# Altium schematic sheet Single_Stage.SchDoc
size A4; SheetNumber: 1; SheetTotal: 1
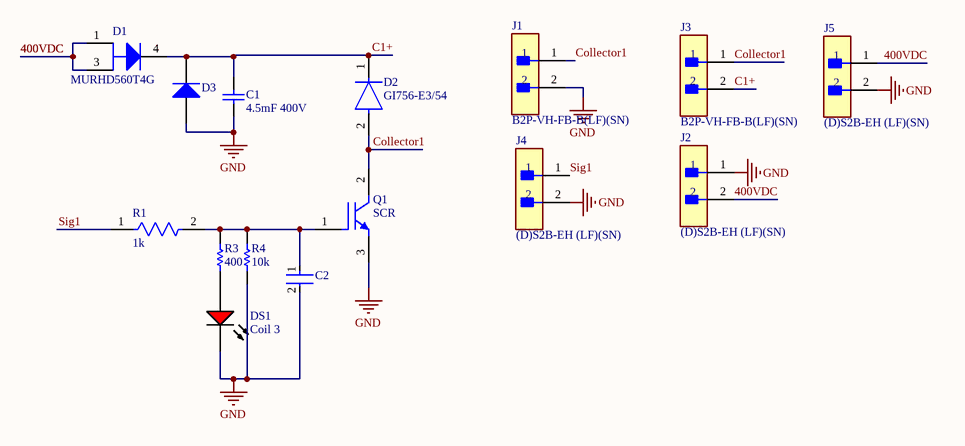
[diagram p0: Single_Stage.SchDoc]

## Parts
C1  value 4.5mF 400V  (hidden comment: asas)
C2  CGA3E2X7R1H104K080AA  [FP-CGA3E-0_3-0_1-IPC_A]  (value not drawn)
D1  MURHD560T4G  [ONSC-DPAK-3-369C-01_V]
D2  GI756-E3/54  [FP-P600-MFG]
D3  R  [DIOD-S1M-13-F-SMA-2_V]  (value not drawn)
DS1  Coil 3  [VISH-TLMX1100_V]
J1  B2P-VH-FB-B(LF)(SN)  [FP-B2P-VH-FB-B_LF_SN-MFG]
J2  (D)S2B-EH (LF)(SN)  [FP-D_S2B-EH_LF_SN-MFG]
J3  B2P-VH-FB-B(LF)(SN)  [FP-B2P-VH-FB-B_LF_SN-MFG]
J4  (D)S2B-EH (LF)(SN)  [FP-D_S2B-EH_LF_SN-MFG]
J5  (D)S2B-EH (LF)(SN)  [FP-D_S2B-EH_LF_SN-MFG]
Q1  SCR  [INF-PG-TO247-3-44_A]
R1  1k  [FP-CRCW2512-e3-MFG]
R3  400  [RESC1609X50X30NL8T20]
R4  10k  [RESC1609X50X30NL8T20]

## Nets
GND: C1.1 C2.2 D3.1(A) DS1.2(K) J1.2 J2.1 J4.2 J5.2 Q1.3(E) R4.1
400VDC: D1.1(A) D1.3(A) J2.2 J5.1
C1+: C1.2 D1.4(K) D2.1(C) D3.2(K) J3.2
Collector1: D2.2(A) J1.1 J3.1 Q1.2(C)
Sig1: J4.1 R1.1
NetC2_1: C2.1 Q1.1(G) R1.2 R3.2 R4.2
NetDS1_1: DS1.1(A) R3.1

## Library data of the parts
C1 = Capacitor: SimulationGenericComponent: True
C2 = CMP-2000-07546-2: Cap Ceramic 100nF 50V X7R 10% Pad SMD 0603 +125°C Automotive T/R; Weight: 7.1E-05oz; Composition: Ceramic; Max Operating Temperature: 125°C; Termination: SMD/SMT; Dielectric: X7R; Length: 1.6mm; Package Quantity: 1; REACH SVHC: No SVHC; Lead Free: Lead Free; Case Code (Metric): 1608; Min Operating Temperature: -55°C; Packaging: Tape and Reel; Tolerance: 10%; Voltage Rating: 50V; Case Code (Imperial): 0603; Capacitance: 100nF; Case/Package: 0603; Voltage Rating (DC): 50V; Depth: 0.8mm; Radiation Hardening: No; Ratings: AEC-Q200; Mount: Surface Mount; Voltage: 50V; Thickness: 0.035inch; Width: 0.8mm; Height: 0.8mm
D1 = CMP-0902-00243-1: Power Rectifier, 3-Pin DPAK, Pb-Free, Tape and Reel; Manufacturer: On Semiconductor; Type: Ultrafast; VRRM Max (V): 600; IFSM Max (A): 50; Mounting Technology: Surface Mount; RoHS: TRUE; PartNumber: MURHD560T4G; PackageVersion: Rev. E, 02/2014; ComponentLink3URL: http://www.onsemi.cn/pub_link/Collateral/369C.PDF; ComponentLink1Description: Manufacturer URL; PackageDescription: 3-Pin Flange Mount, Body 6.54 x 6.095 mm, Pitch 2.29 mm; ComponentLink3Description: Package Specification; ComponentLink1URL: http://www.onsemi.com/; Packing: Tape and Reel; ComponentLink2URL: http://www.onsemi.cn/pub_link/Collateral/MURHD560-D.PDF; ComponentLink2Description: Datasheet; PackageReference: DPAK-3-369C-01; DatasheetVersion: Rev. 8
D2 = CMP-02540-000099-1: DIODE GEN PURP 600V 6A P600; Capacitance: 150pF; Max Surge Current: 400A; Max Reverse Current: 5uA; Forward Voltage: 1.25V; Diode Type: RECTIFIER; Element Configuration: Single; Recovery Time: 2500ns; Voltage: 1.2kV; Polarity: Standard; Case/Package: P; Forward Current: 6A; Mount: Through Hole; Diameter: 9.1mm; Peak Non-Repetitive Surge Current: 400A; Average Rectified Current: 6A; Max Forward Surge Current (Ifsm): 400A; Width: 9.1mm; RoHS Compliant: Yes; Max Reverse Voltage (DC): 600V; Number of Pins: 2; Lead Free: Lead Free; Max Repetitive Reverse Voltage (Vrrm): 600V; Packaging: Tape and Reel; Output Current: 6A; Length: 0.358inch; Max Operating Temperature: 150°C; Current: 400A; Radiation Hardening: No; Height: 9.1mm; Reverse Voltage: 600V; Min Operating Temperature: -50°C; Package Quantity: 1; Reverse Recovery Time: 2500ns
D3 = CMP-0639-00001-1: Surface Mount Glass Passivated Rectifier, 1000V, 1 A, -65 to 125 degC, 2-Pin SMA Package, RoHS, Tape and Reel; Manufacturer: Diodes Inc; PartNumber: S1M-13-F; Maximum Reverse Current IR (uA): 5; Maximum Peak Forward Surge Current IFSM (A): 30; Maximum Average Rectified Current IO (A): 1; Peak Repetitive Reverse Voltage VRRM (V): 1000; Total Capacitance CT (pF): 10; Forward Voltage Drop VF (V): 1.1; ComponentLink1URL: http://www.diodes.com/; Operating Temperature Range: -65 to 150 degC; ComponentLink3URL: http://diodes.com/datasheets/ds16003.pdf; ComponentLink3Description: Package Specification; PackageDescription: 2-Pin SMD, Body 4.3 x 2.605 mm, Height 2.3 mm; Mounting Technology: Surface Mount; ComponentLink1Description: Manufacturer URL; PackageReference: S1M-13-F-SMA-2; ComponentLink2URL: http://diodes.com/datasheets/ds16003.pdf; ComponentLink2Description: Datasheet; RoHS: TRUE; DatasheetVersion: Rev. 22 - 2; Packing: Tape and Reel; PackageVersion: Rev. 22 - 2
DS1 = CMP-1666-00027-1: LED, RED, 2.1 V, -40 to 100 degC, 2-Pin SMD (0603), RoHS, Tape and Reel; Type (Capacitors): C0G; Resistance: 100000000000 Ohm; Capacitance: 12 pF; Voltage Rating: 50 V; Tolerance: 5%; Min Operating Temperature: -55degC; REACH SVHC: No SVHC; ComponentLink2Description: Datasheet; ComponentLink1URL: http://www.vishay.com/; Width: 0.8 mm; Package Quantity: 4000; PackageReference: TLMX1100; ComponentLink2URL: http://www.vishay.com/docs/83173/tlmb1100.pdf; Case/Package: 0603; Case Code (Metric): 1608; Packaging: Tape and Reel; Pins: 2; ComponentLink1Description: Manufacturer URL; Max Operating Temperature: 125degC; Height: 0.8 mm; Length: 1.6 mm; Mount: Surface Mount; PackageDescription: 2-Pin Surface Mount Device, Body 1.6 x 0.8 mm; DatasheetVersion: Rev. 2.7, 03/2016; Case Code (Imperial): 0603; Voltage Rating (DC): 50 V; RoHSCompliant: True; Radiation Hardening: No
J1 J3 = CMP-17439-000031-1: CONN HEADER VERT 2POS 3.96MM; Connector Type: Male Pin; Pitch: 0.156inch; Number of Positions: 2; Packaging: Bulk; Package Quantity: 250; Termination: Solder; Lead Free: Lead Free; Contact Plating: Tin; Contact Type: Male Pin; Color: Natural; Fastening Type: Ramp; Number of Rows: 1; Mount: Through Hole; Series: VH
J2 J4 J5 = CMP-17439-000238-1: CONN HEADER R/A 2POS 2.5MM
Q1 = CMP-1168-00055-1: High Speed IGBT in NPT-Technology, PG-TO247-3-44, Tube, Green; PartNumber: SGW30N60HS; Manufacturer: Infineon; Switching Frequency: HighSpeed 30-100 kHz; VCE(sat) (typ): 2.8 V; IC(max) @ 100 degC: 30 A; IC(max) @ 25 degC: 41 A; VCE (max): 600 V; Green: TRUE; ComponentLink1Description: Manufacturer URL; ComponentLink2URL: http://www.infineon.com/dgdl/SGP_W30N60HS_Rev2_4G.pdf?folderId=db3a304412b407950112b408e8c90004&fileId=db3a304412b407950112b427ac823c95; Packing: Tube; DatasheetVersion: Rev. 2.4; PackageReference: PG-TO247-3-44_A; PackageVersion: Rev. 05, 07/2010; ComponentLink2Description: Datasheet; Halogen-free: FALSE; PackageDescription: 3-Pin Plastic (Green) Transistor Single Outline Package, Body 15.915 x 20.95 mm, Pitch 5.44 mm; ComponentLink3Description: Package Specification; RevisionNote: Lost Devices pt2; ComponentLink3URL: http://www.infineon.com/dgdl/IDW10S120_Rev+2.pdf?folderId=db3a304314dca38901151224afae0c96&fileId=db3a304336724dc40136789691a04aa5; Mounting Technology: Through Hole; ComponentLink1URL: http://www.infineon.com/
R1 = CMP-02407-004199-1: RES Thick Film, 100kΩ, 1%, 1W, 100ppm/°C, 2512; Voltage Rating: 500V; Resistance: 100kR; Case Code (Metric): 6432; Temperature Coefficient: 100ppm/°C; Weight: 0.001429oz; Radiation Hardening: No; Voltage Rating (DC): 500V; Case Code (Imperial): 2512; Length: 6.3mm; Number of Pins: 2; Military Standard: Not; Packaging: Tape and Reel; Contact Plating: Tin; Width: 3.15mm; Lead Free: Lead Free; Package Quantity: 2000; Composition: Thick Film; Termination: SMD/SMT; Number of Terminations: 2; Features: Automotive AEC-Q200; Max Power Dissipation: 1W; Case/Package: 2512; Min Operating Temperature: -55°C; Depth: 3.15mm; Max Operating Temperature: 155°C; Tolerance: 1%; Power Rating: 1W; Height: 0.6mm
R3 R4 = CMP-1666-00005-4: Chip Resistor, 10 KOhm, +/- 1%, 100 mW, -55 to 155 degC, 0603 (1608 Metric), RoHS, Tape and Reel; Manufacturer: Vishay Semiconductor; Voltage Rating: 75 V; Max Operating Temperature: 155 degC; PackageDescription: 2-Pin Surface Mount Device, Body 1.575 x 0.85 mm; ComponentLink1Description: Manufacturer URL; RoHSCompliant: true; PackageReference: 0603; REACH SVHC: Unknown; Length: 1.55 mm; DatasheetVersion: 06/2012; Packaging: Tape and Reel; Min Operating Temperature: -55 degC; Mounting Technology: Surface Mount; ComponentLink2URL: https://datasheet.ciiva.com/11809/0900766b80d98afc-11809037.pdf; Height: 0.45 mm; ComponentLink2Description: Datasheet; Package Quantity: 5000; ComponentLink1URL: http://www.vishay.com/